# Altium schematic sheet Beacon.SchDoc
size A3
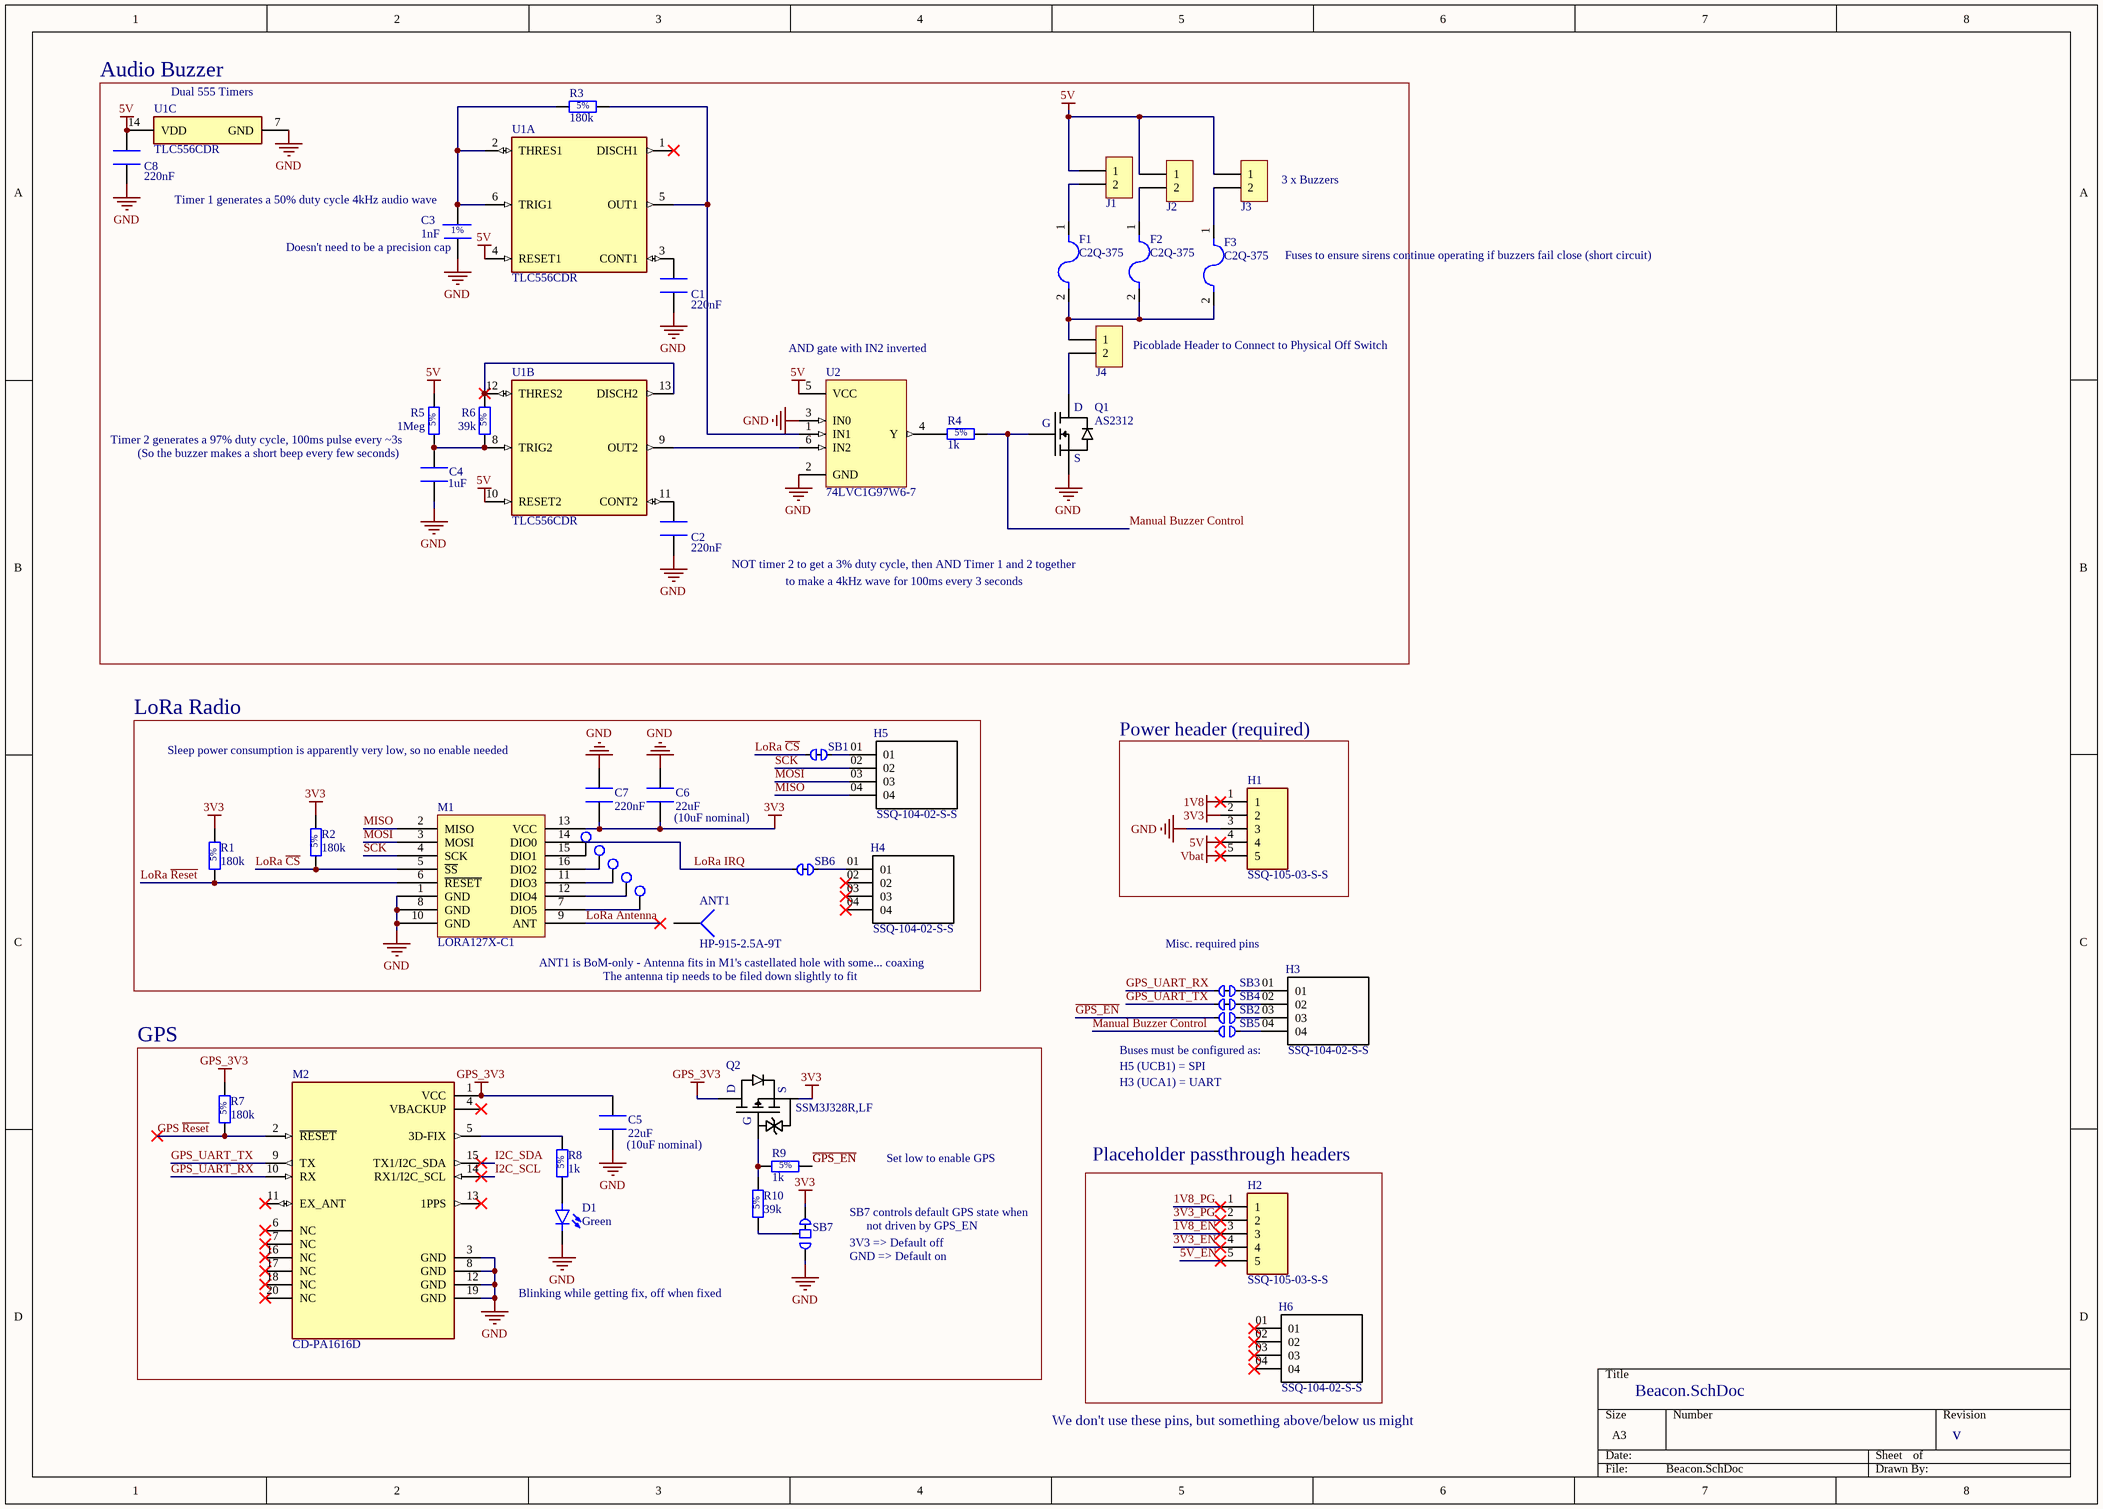
[diagram p0: Beacon.SchDoc]

## Parts
ANT1  HP-915-2.5A-9T  (mechanical)
C1  220nF  [CAPACITOR_0805_2012M-70N]
C2  220nF  [CAPACITOR_0805_2012M-70N]
C3  1nF  [CAPACITOR_0805_2012M-70N]
C4  1uF  [CAPACITOR_0805_2012M-70N]
C5  22uF  [CAPACITOR_0805_2012M-70N]
C6  22uF  [CAPACITOR_0805_2012M-70N]
C7  220nF  [CAPACITOR_0805_2012M-70N]
C8  220nF  [CAPACITOR_0805_2012M-70N]
D1  Colour: Green  [LED_0603_1608M_0.80mm]  (hidden comment: LTST-C190 Series)
F1  C2Q-375  [FUSC1608X56N]
F2  C2Q-375  [FUSC1608X56N]
F3  C2Q-375  [FUSC1608X56N]
H1  SSQ-105-03-S-S  [SAMTEC_SSQ-105-03-S-S]  (no BOM)
H2  SSQ-105-03-S-S  [SAMTEC_SSQ-105-03-S-S]  (no BOM)
H3  SSQ-104-02-S-S  [*SAMTEC_SSQ-104-02-S-S_SSQ-104-02-S-S(Primary)]  (no BOM)
H4  SSQ-104-02-S-S  [*SAMTEC_SSQ-104-02-S-S_SSQ-104-02-S-S(Primary)]  (no BOM)
H5  SSQ-104-02-S-S  [*SAMTEC_SSQ-104-02-S-S_SSQ-104-02-S-S(Primary)]  (no BOM)
H6  SSQ-104-02-S-S  [*SAMTEC_SSQ-104-02-S-S_SSQ-104-02-S-S(Primary)]  (no BOM)
J1  0530480210  [MOLEX_0530480210]  (value not drawn)
J2  0530480210  [MOLEX_0530480210]  (value not drawn)
J3  0530480210  [MOLEX_0530480210]  (value not drawn)
J4  0530480210  [MOLEX_0530480210]  (value not drawn)
M1  LORA127X-C1  [LoRa127X-C1]
M2  CD-PA1616D  [XCVR_CD-PA1616D]
Q1  AS2312  [SOT23-3N-1.15mm]
Q2  SSM3J328R,LF  [SOT23F-3-0.8mm]
R1  180k  [Resistor_0805_2012M-50N]
R2  180k  [Resistor_0805_2012M-50N]
R3  180k  [Resistor_0805_2012M-50N]
R4  1k  [Resistor_0805_2012M-50N]
R5  1Meg  [Resistor_0805_2012M-50N]
R6  39k  [Resistor_0805_2012M-50N]
R7  180k  [Resistor_0805_2012M-50N]
R8  1k  [Resistor_0805_2012M-50N]
R9  1k  [Resistor_0805_2012M-50N]
R10  39k  [Resistor_0805_2012M-50N]
SB1  Solder Jumper Normally Closed 0201  [Solder Bridge Closed 0201]  (value not drawn)  (net tie, no BOM)
SB2  Solder Jumper Normally Open 0201  [Solder Bridge Open 0201]  (value not drawn)  (no BOM)
SB3  Solder Jumper Normally Closed 0201  [Solder Bridge Closed 0201]  (value not drawn)  (net tie, no BOM)
SB4  Solder Jumper Normally Closed 0201  [Solder Bridge Closed 0201]  (value not drawn)  (net tie, no BOM)
SB5  Solder Jumper Normally Open 0201  [Solder Bridge Open 0201]  (value not drawn)  (no BOM)
SB6  Solder Jumper Normally Closed 0201  [Solder Bridge Closed 0201]  (value not drawn)  (net tie, no BOM)
SB7  Solder Jumper 3-pin Left connected 0201  [Solder Bridge 3-pin Left shorted 0201]  (value not drawn)  (net tie, no BOM)
T1  Test Pad  [Test Pad]  (value not drawn)  (no BOM)
T2  Test Pad  [Test Pad]  (value not drawn)  (no BOM)
T3  Test Pad  [Test Pad]  (value not drawn)  (no BOM)
T4  Test Pad  [Test Pad]  (value not drawn)  (no BOM)
T5  Test Pad  [Test Pad]  (value not drawn)  (no BOM)
U1  TLC556CDR  [SOIC-14N-3.9mmBody-1.75mm]  (parts A,B,C of 3)
U2  74LVC1G97W6-7  [SOT23-6N-1.4mm]

## Blocks framed on the sheet
Audio Buzzer: C1-C4 C8 F1-F3 J1-J4 Q1 R3-R6 U1 U2
LoRa Radio: ANT1 C6 C7 H4 H5 M1 R1 R2 SB1 SB6 T1-T5
Power header (required): H1
GPS: C5 D1 M2 Q2 R7-R10 SB7
Placeholder passthrough headers: H2 H6

## Nets
1V8: H1.1
3V3: C6.1 C7.1 H1.2 M1.13(VCC) Q2.2(S) R1.2 R2.2 SB7.2
5V: C8.2 H1.4 J1.1 J2.1 J3.1 R5.2 U1.4(RESET1) U1.10(RESET2) U1.14(VDD) U2.5(VCC)
GND: C1.1 C2.1 C3.1 C4.1 C5.1 C6.2 C7.2 C8.1 D1.C H1.3 M1.1(GND) M1.8(GND) M1.10(GND) M2.3(GND) M2.8(GND) M2.12(GND) M2.19(GND) Q1.2(S) SB7.3 U1.7(GND) U2.2(GND) U2.3(IN0)
GPS_3V3: C5.2 M2.1(VCC) Q2.3(D) R7.2
Vbat: H1.5
1V8_EN: H2.3
1V8_PG: H2.1
3V3_EN: H2.4
3V3_PG: H2.2
5V_EN: H2.5
~{GPS_EN}: R9.2 SB2.1  [also labelled GPS_EN]
GPS ~{Reset}: M2.2(~{RESET}) R7.1
GPS_UART_RX: M2.10(RX) SB3.1
GPS_UART_TX: M2.9(TX) SB4.1
I2C_SCL: M2.14(RX1/I2C_SCL)
I2C_SDA: M2.15(TX1/I2C_SDA)
LoRa Antenna: M1.9(ANT)
LoRa ~{CS}: M1.5(~{SS}) R2.1 SB1.1
LoRa IRQ: M1.14(DIO0) SB6.1
LoRa ~{Reset}: M1.6(~{RESET}) R1.1
Manual Buzzer Control: Q1.1(G) R4.2 SB5.1
MISO: H5.04 M1.2(MISO)
MOSI: H5.03 M1.3(MOSI)
SCK: H5.02 M1.4(SCK)
NetC1_2: C1.2 U1.3(CONT1)
NetC2_2: C2.2 U1.11(CONT2)
NetC3_2: C3.2 R3.1 U1.2(THRES1) U1.6(TRIG1)
NetC4_2: C4.2 R5.1 R6.1 U1.8(TRIG2)
NetD1_A: D1.A R8.1
NetF1_1: F1.1 J1.2
NetF1_2: F1.2 F2.2 F3.2 J4.1
NetF2_1: F2.1 J2.2
NetF3_1: F3.1 J3.2
NetH3_01: H3.01 SB3.2
NetH3_02: H3.02 SB4.2
NetH3_03: H3.03 SB2.2
NetH3_04: H3.04 SB5.2
NetH4_01: H4.01 SB6.2
NetH5_01: H5.01 SB1.2
NetJ4_2: J4.2 Q1.3(D)
NetM1_7: M1.7(DIO5) T5.1
NetM1_11: M1.11(DIO3) T3.1
NetM1_12: M1.12(DIO4) T4.1
NetM1_15: M1.15(DIO1) T1.1
NetM1_16: M1.16(DIO2) T2.1
NetM2_5: M2.5(3D-FIX) R8.2
NetQ2_1: Q2.1(G) R9.1 R10.2
NetR3_2: R3.2 U1.5(OUT1) U2.1(IN1)
NetR4_1: R4.1 U2.4(Y)
NetR6_2: R6.2 U1.12(THRES2) U1.13(DISCH2)
NetR10_1: R10.1 SB7.1(Common)
NetU1_9: U1.9(OUT2) U2.6(IN2)

Not connected (* = marked no-connect by the designer): ANT1 1; H4 02* 03* 04*; H6 01* 02* 03* 04*; M2 4(VBACKUP)* 6(NC)* 7(NC)* 11(EX_ANT)* 13(1PPS)* 16(NC)* 17(NC)* 18(NC)* 20(NC)*; U1 1(DISCH1)*

## Notes on the sheet
- (near U1) Dual 555 Timers
- (near J3) 3 x Buzzers
- (near C3) Timer 1 generates a 50% duty cycle 4kHz audio wave
- (near C3) Doesn't need to be a precision cap
- Fuses to ensure sirens continue operating if buzzers fail close (short circuit)
- (near U2) AND gate with IN2 inverted
- Picoblade Header to Connect to Physical Off Switch
- (near R5) Timer 2 generates a 97% duty cycle, 100ms pulse every ~3s
- (So the buzzer makes a short beep every few seconds)
- NOT timer 2 to get a 3% duty cycle, then AND Timer 1 and 2 together
- to make a 4kHz wave for 100ms every 3 seconds
- (near C7) Sleep power consumption is apparently very low, so no enable needed
- (near C6) (10uF nominal)
- ANT1 is BoM-only - Antenna fits in M1's castellated hole with some... coaxing
- The antenna tip needs to be filed down slightly to fit
- Misc. required pins
- Buses must be configured as:
- H5 (UCB1) = SPI
- H3 (UCA1) = UART
- (near C5) (10uF nominal)
- Set low to enable GPS
- (near SB7) 3V3 => Default off
- SB7 controls default GPS state when
- (near SB7) GND => Default on
- not driven by GPS_EN
- Blinking while getting fix, off when fixed
- (near H6) We don't use these pins, but something above/below us might
- v
- (in symbol GCM2165CxxxxxF Series) 1%

## Library data of the parts
ANT1 = Socket: Spring Antenna; MF Part No.: HP-915-2.5A-9T
C1 C2 C7 C8 = C0805C224K1RAC7800: Passive - Capacitor, X7R, 220nF Max, 100V, 0805 (2012 Metric), ±10%, -55°C ~ 85°C. 200nF @ 10V, 110nF @ 50V, 55nF @ 100V; APSS Standard Part: APSS Standard; Capacitance at Rated Voltage: 25%; Tolerance: ±10%; Temperature Coefficient: X7R; Rated Voltage: 100V; Temp Range: -55°C ~ 85°C; Package: 0805; Supplier 1: Digikey; Supplier 1 Part No.: 399-C0805C224K1RAC7800CT-ND; MF Part No.: C0805C224K1RAC7800; Value: 220nF
C3 = GCM2165CxxxxxF Series: Passive - Capacitor Series, 0805, C0G, 50V, ±1%, -55°C ~ 125°C, 0805 (2012 Metric); MF Part No.: GCM2165C1H102FA16D; APSS Standard Part: APSS Standard; Capacitance at Rated Voltage: 100%; Value Range: 5pF ~ 22nF; E Series: E24; Tolerance: ±1%; Temperature Coefficient: C0G; Rated Voltage: 50V; Temp Range: -55°C ~ 125°C; Supplier 1: Digikey; Package: 0805; Value: 1nF
C4 = Generic Capacitor: MF Part No.: C0805C105K3PACTU; Tolerance: ±10%; Temperature Coefficient: X5R; Rated Voltage: 50V; Temp Range: -55°C ~ 85°C; Supplier 1: Digikey; Supplier 1 Part No.: 399-C0805C105K3PAC7800CT-ND; Package: 0805; Value: 1uF
C5 C6 = C0805C226M9PACTU: Passive - Capacitor, X5R, 22uF Max, 6.3V, 0805 (2012 Metric), ±20%, -55°C ~ 85°C. 8.8uF @ 5V; APSS Standard Part: APSS Standard; Capacitance at Rated Voltage: 30%; Tolerance: ±20%; Temperature Coefficient: X5R; Rated Voltage: 6.3V; Temp Range: -55°C ~ 85°C; Package: 0805; Supplier 1: Digikey; Supplier 1 Part No.: 399-C0805C226M9PAC7800CT-ND; MF Part No.: C0805C226M9PACTU; Value: 22uF
D1 = LTST-C190 Series: Diode - LED, 0603; MF Part No.: LTST-C190KGKT; APSS Standard Part: APSS Standard; Temp Range: -30°C ~ 85°C; Rated Voltage: 5V Reverse; Package: 0603; Supplier 1: Digikey
J1-J4 = 0530480210: Header - Picoblade 02-pin, TH, RA; APSS Standard Part: APSS Standard; Pitch: 1.25mm; Mounting Type: Through-hole; Orientation: Right Angle; MF Part No.: 0530480210; Pins: 2; Supplier 1: Digikey; Supplier 1 Part No.: WM1742-ND
M1 = LORA127X-C1: LoRa transceiver; MF Part No.: LORA127X-C1
M2 = CD-PA1616D: CD-PA1616D GNSS patch antenna module; MF Part No.: CD-PA1616D
Q1 = AS2312: Transistor - MOSFET, N-Channel AS2312; APSS Standard Part: APSS Standard; Temp Range: 0°C ~ 150°C (TJ); Rated Voltage: 20 Vds; Power: 1.2W; Package: SOT23-3; MF Part No.: AS2312; Supplier 1: Digikey; Supplier 1 Part No.: 4530-AS2312CT-ND
Q2 = SSM3J328R,LF: Transistor - MOSFET, P-Channel SSM3J328R,LF; APSS Standard Part: APSS Standard; Temp Range: 0°C ~ 150°C (TJ); Rated Voltage: 20 Vds; Power: 1W; MF Part No.: SSM3J328R,LF; Package: SOT23-3; Supplier 1: Digikey; Supplier 1 Part No.: SSM3J328RLFCT-ND
R1-R3 R7 = RMCF0805JT Series: Passive - Resistor Series, 0805, 5%, 100m - 22M, E24, 0.063W, 1/16W, ±200ppm/°C, -55°C ~ 155°C, 0805 (2012 Metric); MF Part No.: RMCF0805JT180K; APSS Standard Part: APSS Standard; Power: 1/8W; Value Range: 100m ~ 22M; Rated Voltage: 150V; Tolerance: 5%; E Series: E24; Temp Range: -55°C ~ 155°C; Supplier 1: Digikey; Package: 0805; Temperature Coefficient: ±200ppm/°C; Value: 180k
R4 R8 R9 = RMCF0805JT Series: Passive - Resistor Series, 0805, 5%, 100m - 22M, E24, 0.063W, 1/16W, ±200ppm/°C, -55°C ~ 155°C, 0805 (2012 Metric); MF Part No.: RMCF0805JT1K00; APSS Standard Part: APSS Standard; Power: 1/8W; Value Range: 100m ~ 22M; Rated Voltage: 150V; Tolerance: 5%; E Series: E24; Temp Range: -55°C ~ 155°C; Supplier 1: Digikey; Package: 0805; Temperature Coefficient: ±200ppm/°C; Value: 1k
R5 = RMCF0805JT Series: Passive - Resistor Series, 0805, 5%, 100m - 22M, E24, 0.063W, 1/16W, ±200ppm/°C, -55°C ~ 155°C, 0805 (2012 Metric); MF Part No.: RMCF0805JT1M00; APSS Standard Part: APSS Standard; Power: 1/8W; Value Range: 100m ~ 22M; Rated Voltage: 150V; Tolerance: 5%; E Series: E24; Temp Range: -55°C ~ 155°C; Supplier 1: Digikey; Package: 0805; Temperature Coefficient: ±200ppm/°C; Value: 1Meg
R6 R10 = RMCF0805JT Series: Passive - Resistor Series, 0805, 5%, 100m - 22M, E24, 0.063W, 1/16W, ±200ppm/°C, -55°C ~ 155°C, 0805 (2012 Metric); MF Part No.: RMCF0805JT39K0; APSS Standard Part: APSS Standard; Power: 1/8W; Value Range: 100m ~ 22M; Rated Voltage: 150V; Tolerance: 5%; E Series: E24; Temp Range: -55°C ~ 155°C; Supplier 1: Digikey; Package: 0805; Temperature Coefficient: ±200ppm/°C; Value: 39k
SB7 = Solder Jumper 3-pin Normally Closed 0201: DEBUG: DEBUG
U1 = TLC556CDR: IC - Timer, 2-Channel, 2.1-MHz, 2x720uA, 14-SOIC, 0 to 70; APSS Standard Part: APSS Standard; Temp Range: 0°C ~ 70°C; Rated Voltage: 15V; MF Part No.: TLC556CDR; Package: SOIC-14; Supplier 1: Digikey; Supplier 1 Part No.: 296-1338-1-ND
U2 = 74LVC1G97W6-7: IC - Multifunction Logic Gate, 1 Circuit, 3 Input, 1.65 - 5.5V, AND, OR, NOT, MUX, SOT-23-6; APSS Standard Part: APSS Standard; Temp Range: -40°C ~ 125°C; Package: SOT-23-6; Rated Voltage: 5.5V; Supplier 1: Digikey; Supplier 1 Part No.: 74LVC1G97W6-7; MF Part No.: 74LVC1G97W6-7
F1-F3 = C2Q-375: Package: None; Price: None; Value: *; MP: C2Q-375; Availability: Unavailable
H1 H2 = SSQ-105-03-S-S: MF Part No.: SSQ-105-03-S-S
SB1 SB3 SB4 SB6 = Solder Jumper Normally Closed 0201: DEBUG: DEBUG
SB2 SB5 = Solder Jumper Normally Open 0201: DEBUG: DEBUG